# Altium schematic sheet LCD_BT.SchDoc
size A3; SheetNumber: 2; SheetTotal: 3
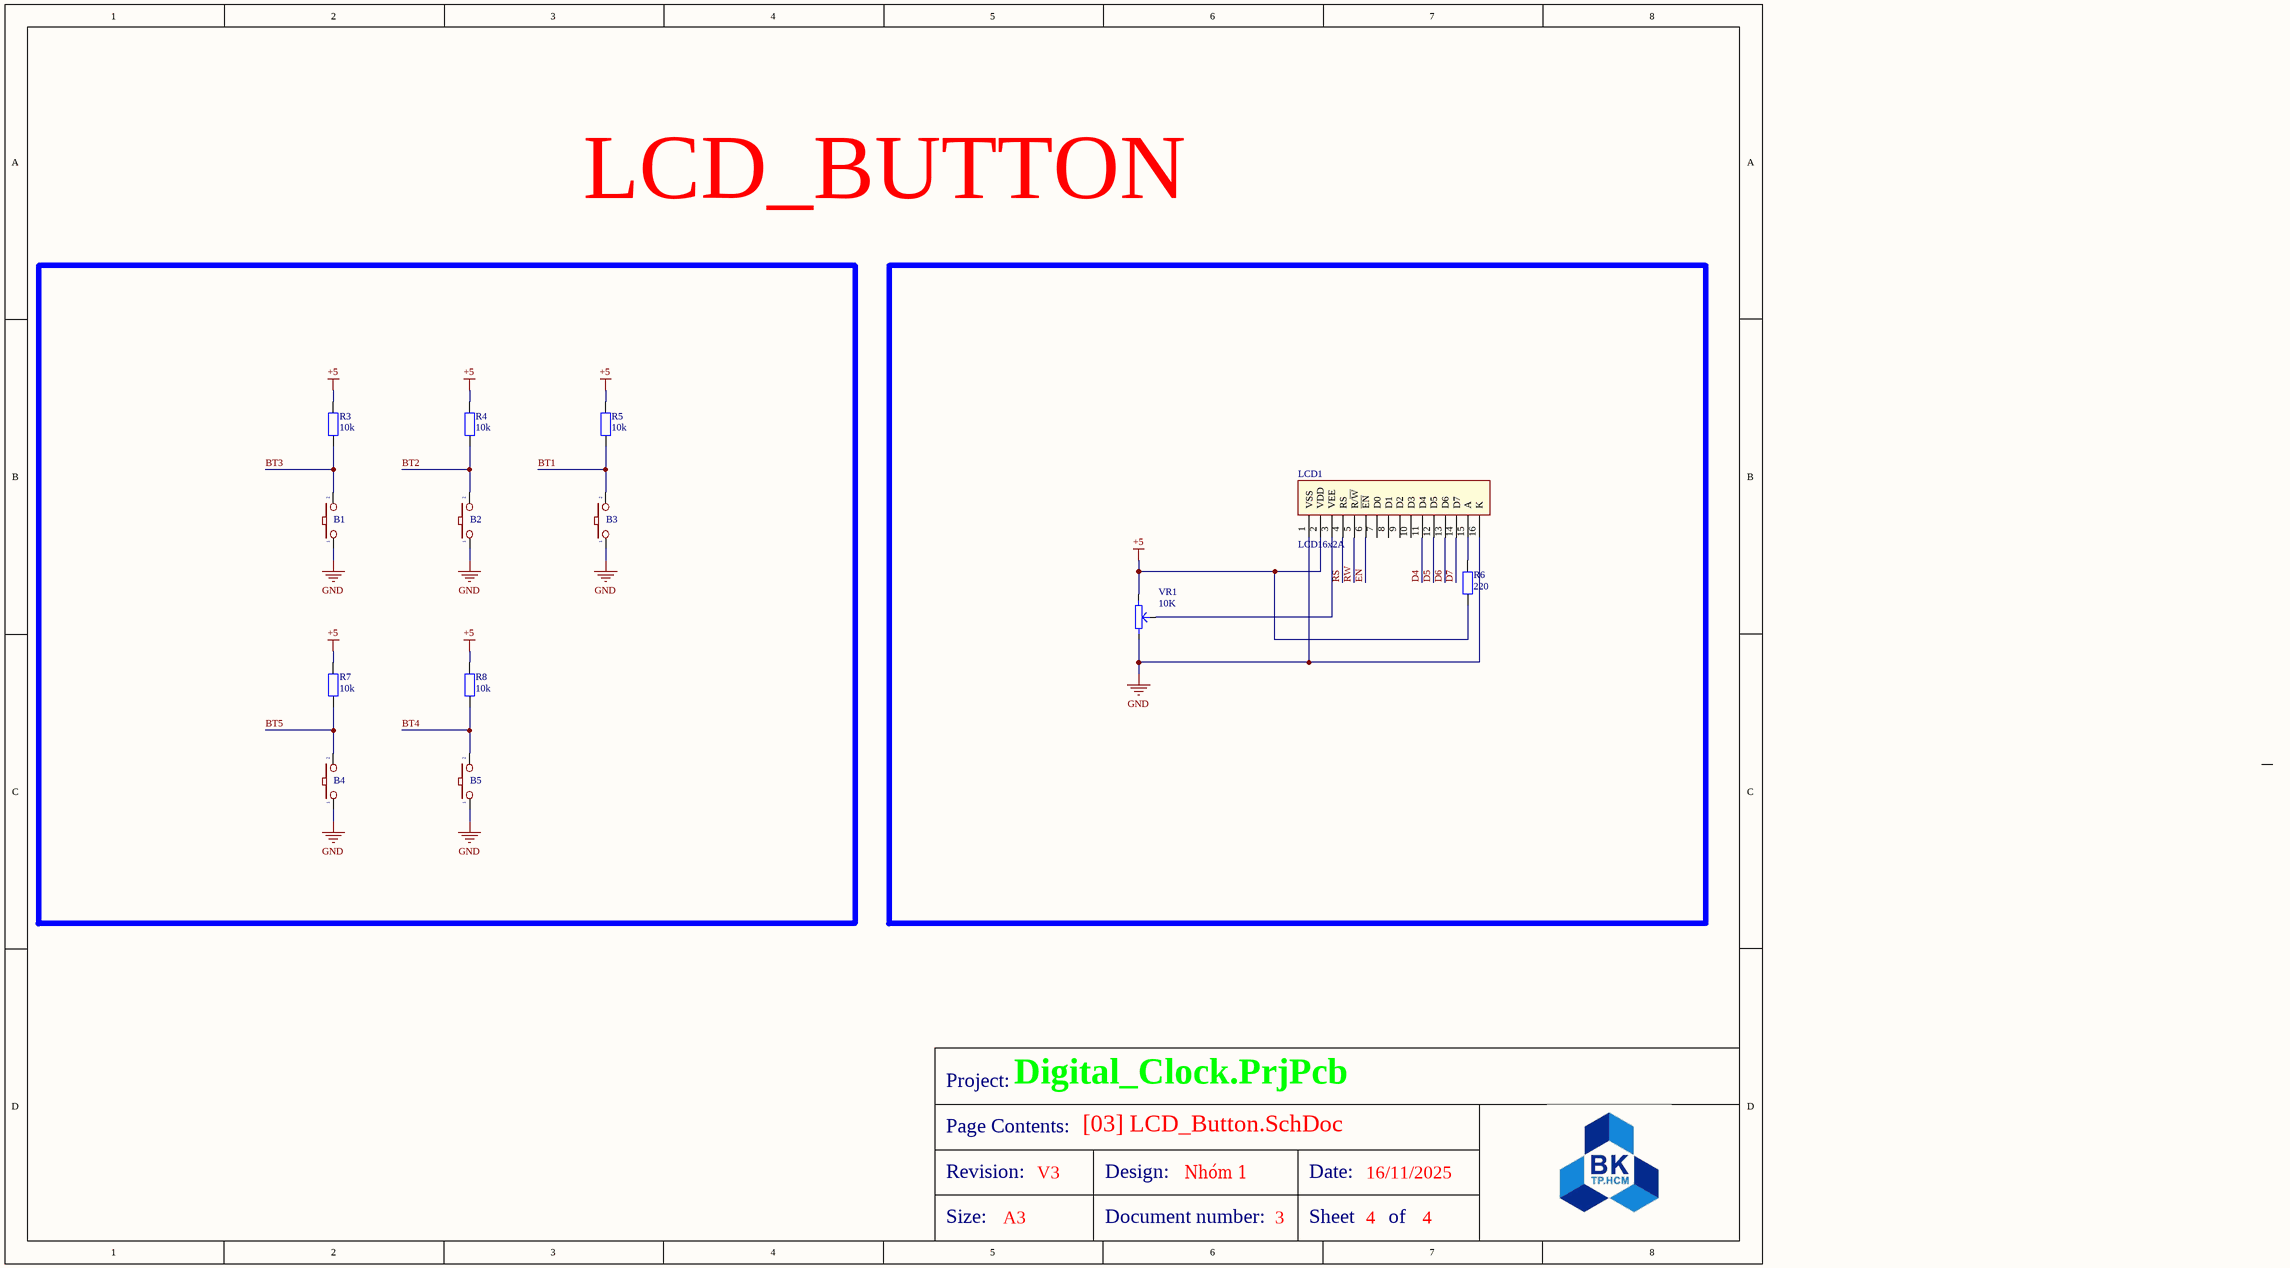
[diagram p0: LCD_BT.SchDoc]

## Parts
B1  (no value)  [SW2]
B2  (no value)  [SW2]
B3  (no value)  [SW2]
B4  (no value)  [SW2]
B5  (no value)  [SW2]
LCD1  LCD16x2A  [LCD16X2]
R3  10k  [R1/4W]
R4  10k  [R1/4W]
R5  10k  [R1/4W]
R6  220  [R1/4W]
R7  10k  [R1/4W]
R8  10k  [R1/4W]
VR1  10K  [Bien Tro Tam Giac Dung]

## Nets
+5: LCD1.2(VDD) R3.2 R4.2 R5.2 R6.1 R7.2 R8.2 VR1.1
GND: B1.1 B2.1 B3.1 B4.1 B5.1 LCD1.1(VSS) LCD1.16(K) VR1.3
BT1: B3.2 R5.1
BT2: B2.2 R4.1
BT3: B1.2 R3.1
BT4: B5.2 R8.1
BT5: B4.2 R7.1
D4: LCD1.11(D4)
D5: LCD1.12(D5)
D6: LCD1.13(D6)
D7: LCD1.14(D7)
EN: LCD1.6(~{EN})
RS: LCD1.4(RS)
RW: LCD1.5(R/~{W})
NetLCD1_3: LCD1.3(VEE) VR1.2
NetLCD1_15: LCD1.15(A) R6.2

Not connected (* = marked no-connect by the designer): LCD1 7(D0) 8(D1) 9(D2) 10(D3)

## Notes on the sheet
- LCD_BUTTON
- Project:
- Digital_Clock.PrjPcb
- Page Contents:
- [03] LCD_Button.SchDoc
- Revision:
- Size:
- A3
- V3
- Design:
- Document number:
- Nhóm 1
- 3
- Date:
- Sheet
- 16/11/2025
- 4
- of

## Library data of the parts
B1-B5 = SW2: Switch button 2 pin; Value: SW chip 2 pin
LCD1 = LCD16x2: LCD dipslay 16 char, 2 line; Value: LCD16x2A
R3-R8 = R1/4W: Resistor 1/4W; Value: R1/4W - 1K
VR1 = Bien tro tam giac 10K Dung: Cắm; Ma_Hang: MH000919; Don_Vi: Con; Ten_Linh_Kien: Biến Trở Tam Giác 103-10K RM065 (Chân Đứng); Chung_Loai: Cắm; Kieu_Chan: *